# Altium schematic sheet NodeBoard.SchDoc: Data Collection Node
size Letter; Date: 24-03-2019; Author: Morten Kals; CompanyName: UBC Ecohydrology; Engineer: Erik and Morten; Organization: UBC Ecohydrology; Address2: Design:; Address3: Erik MacLennan; Address4: Morten Kals; DocumentNumber: DOC-0001; Revision: V1; SheetNumber: 1; SheetTotal: 1; ImagePath: UBC_logo.png
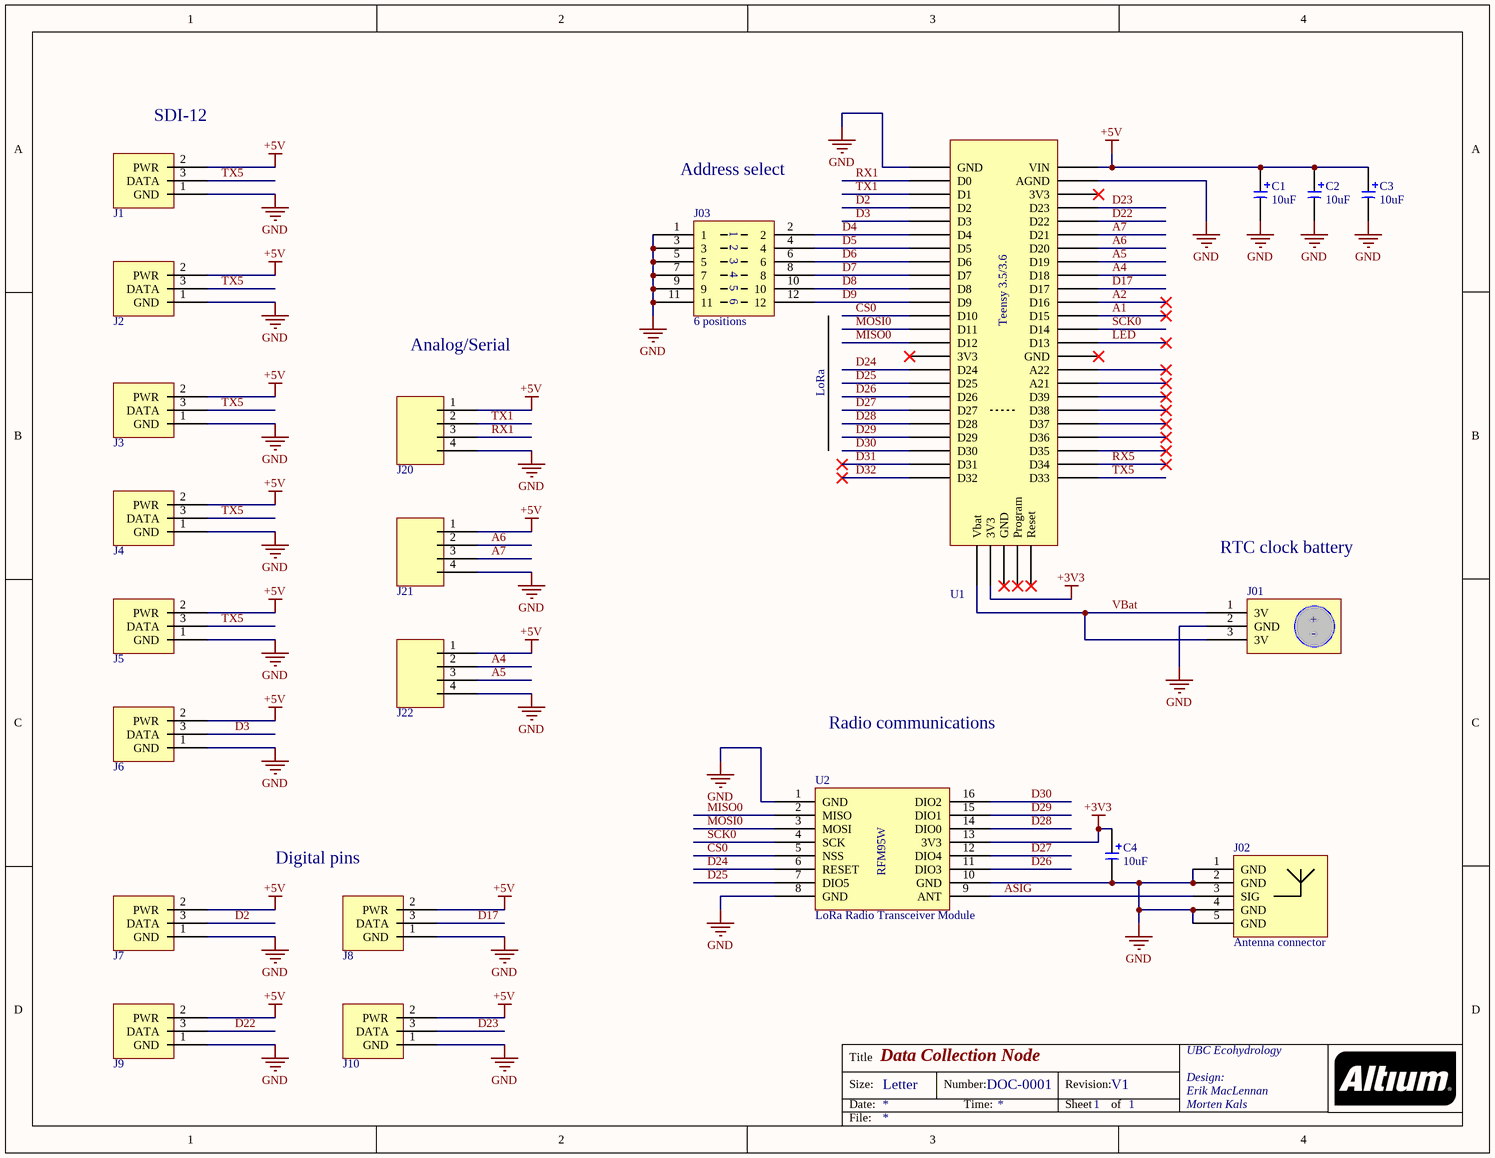
[diagram p0: NodeBoard.SchDoc]

## Parts
C1  10uF  [Cap small electrolytic]
C2  10uF  [Cap small electrolytic]
C3  10uF  [Cap small electrolytic]
C4  10uF  [Cap small electrolytic]
J01  Battery Retainer Coin, 20.0mm 1 Cell SMD (SMT) Tab  [Coin Battery]  (value not drawn)
J1  TERM BLOCK PCB 3POS 3.5MM GREEN  [Terminal Block Sen 3 pos jack]  (value not drawn)
J02  Antenna connector  [SMA Edge Connector]
J2  TERM BLOCK PCB 3POS 3.5MM GREEN  [Terminal Block Sen 3 pos jack]  (value not drawn)
J3  TERM BLOCK PCB 3POS 3.5MM GREEN  [Terminal Block Sen 3 pos jack]  (value not drawn)
J03  6 positions  [DIP SW 6 POS]
J4  TERM BLOCK PCB 3POS 3.5MM GREEN  [Terminal Block Sen 3 pos jack]  (value not drawn)
J5  TERM BLOCK PCB 3POS 3.5MM GREEN  [Terminal Block Sen 3 pos jack]  (value not drawn)
J6  TERM BLOCK PCB 3POS 3.5MM GREEN  [Terminal block SEN 3 pos label]  (value not drawn)
J7  TERM BLOCK PCB 3POS 3.5MM GREEN  [Terminal block SEN 3 pos label]  (value not drawn)
J8  TERM BLOCK PCB 3POS 3.5MM GREEN  [Terminal Block Sen 3 pos jack]  (value not drawn)
J9  TERM BLOCK PCB 3POS 3.5MM GREEN  [Terminal Block Sen 3 pos jack]  (value not drawn)
J10  TERM BLOCK PCB 3POS 3.5MM GREEN  [Terminal block SEN 3 pos label]  (value not drawn)
J20  TERM BLOCK PCB 4POS 3.5MM GREEN  [Terminal block 4 position]  (value not drawn)
J21  TERM BLOCK PCB 4POS 3.5MM GREEN  [Terminal block 4 position]  (value not drawn)
J22  TERM BLOCK PCB 4POS 3.5MM GREEN  [Terminal block 4 position]  (value not drawn)
U1  Teensy 3.5/3.6  [Teensy 3.6]  (value not drawn)
U2  LoRa Radio Transceiver Module  [RFM9x]

## Nets
+3V3: C4.2 U1.50(3V3) U2.13(3V3)
+5V: C1.2 C2.2 C3.2 J1.2(PWR) J2.2(PWR) J3.2(PWR) J4.2(PWR) J5.2(PWR) J6.2(PWR) J7.2(PWR) J8.2(PWR) J9.2(PWR) J10.2(PWR) J20.1 J21.1 J22.1 U1.48(VIN)
GND: C1.1 C2.1 C3.1 C4.1 J1.1(GND) J01.2(GND) J02.1(GND) J2.1(GND) J02.2(GND) J02.4(GND) J02.5(GND) J3.1(GND) J03.1 J03.3 J03.5 J03.7 J03.9 J03.11 J4.1(GND) J5.1(GND) J6.1(GND) J7.1(GND) J8.1(GND) J9.1(GND) J10.1(GND) J20.4 J21.4 J22.4 U1.1(GND) U1.47(AGND) U2.1(GND) U2.8(GND) U2.10(GND)
A1: U1.37(D15)
A2: U1.38(D16)
A4: J22.2 U1.40(D18)
A5: J22.3 U1.41(D19)
A6: J21.2 U1.42(D20)
A7: J21.3 U1.43(D21)
ASIG: J02.3(SIG) U2.9(ANT)
CS0: U1.12(D10) U2.5(NSS)
D2: J7.3(DATA) U1.4(D2)
D3: J6.3(DATA) U1.5(D3)
D4: J03.2 U1.6(D4)
D5: J03.4 U1.7(D5)
D6: J03.6 U1.8(D6)
D7: J03.8 U1.9(D7)
D8: J03.10 U1.10(D8)
D9: J03.12 U1.11(D9)
D17: J8.3(DATA) U1.39(D17)
D22: J9.3(DATA) U1.44(D22)
D23: J10.3(DATA) U1.45(D23)
D24: U1.16(D24) U2.6(RESET)
D25: U1.17(D25) U2.7(DIO5)
D26: U1.18(D26) U2.11(DIO3)
D27: U1.19(D27) U2.12(DIO4)
D28: U1.20(D28) U2.14(DIO0)
D29: U1.21(D29) U2.15(DIO1)
D30: U1.22(D30) U2.16(DIO2)
D31: U1.23(D31)
D32: U1.24(D32)
LED: U1.35(D13)
MISO0: U1.14(D12) U2.2(MISO)
MOSI0: U1.13(D11) U2.3(MOSI)
RX1: J20.3 U1.2(D0)
RX5: U1.26(D34)
SCK0: U1.36(D14) U2.4(SCK)
TX1: J20.2 U1.3(D1)
TX5: J1.3(DATA) J2.3(DATA) J3.3(DATA) J4.3(DATA) J5.3(DATA) U1.25(D33)
VBat: J01.1(3V) J01.3(3V) U1.49(Vbat)

Not connected (* = marked no-connect by the designer): U1 15(3V3)* 27(D35)* 28(D36)* 29(D37)* 30(D38)* 31(D39)* 32(A21)* 33(A22)* 34(GND)* 46(3V3)* 51(GND)* 52(Program)* 53(Reset)*

## Notes on the sheet
- (near J1) SDI-12
- Address select
- Analog/Serial
- LoRa
- RTC clock battery
- Radio communications
- (near J8) Digital pins
- Title
- Size:
- Date:
- Letter
- Number:
- Time:
- Revision:
- Sheet
- of
- File:
- (in symbol Coin Battery) +; -

## Library data of the parts
C1-C4 = Capacitor Electrolytic 10uF
J01 = Coin Battery: Manufacturer: Memory Protection Devices; Manufacturer Part Number: BK-883-TR; Number of Cells: 1; Supplier 1: Digi-Key; Stock 1: 118723; Pricing 1: 1 = 0.73000, 10 = 0.66100, 100 = 0.51380 (USD); RoHS: Yes; Mount: PCB,Surface Mount; Case/Package: SMD/SMT; Min Operating Temperature: -40°C; Max Operating Temperature: 270°C; Package Quantity: 450; Termination: SMD/SMT; Packaging: Cut Tape; Diameter: 20mm; Lead Free: Lead Free; ComponentLink1URL: http://media.digikey.com/pdf/Data%20Sheets/Memory%20Protection%20PDFs/BK-883-TR.pdf?src-supplier=Digi-Key; ComponentLink1Description: http://media.digikey.com/pdf/Data%20Sheets/Memory%20Protection%20PDFs/BK-883-TR.pdf?src-supplier=Digi-Key; Supplier Part Number 1: BK-883-CT-ND
J1-J10 = Terminal Block Sensor: 3 Position Wire to Board Terminal Block 45° (135°) Angle with Board 0.138" (3.50mm) Through Hole; Manufacturer: Phoenix Contact; Manufacturer Part Number: 1985205; Number of Poles: 3; Voltage Rating: 250V; Max Current Rating: 2A; Number of Levels: 1; Voltage: 300V; Wire Gauge (Max): 24AWG; Wire Gauge (Min): 16AWG; Stripping Length: 8mm; Approvals: UL,VDE; Supplier 1: Digi-Key; Stock 1: 12841; Pricing 1: 1=0.41, 10=0.391, 50=0.374, 100=0.3638, 250=0.34, 500=0.3128, 1000=0.289 (USD); Mount: Through Hole; Number of Pins: 3; Weight: 0.054322oz; Colour: Green; Material: Nylon; Housing Colour: Green; Housing Material: Polyamide; Insulation Material: Nylon; Contact Material: Tin; Current Rating: 2A; Package Quantity: 250; Packaging: Bulk; Number of Rows: 1; Max Supply Voltage: 250V; Number of Positions Per Level: 3; Current: 2A; Termination: Solder; Number of Positions: 3; Number of Contacts: 3; Number of Circuits: 3; Length: 12mm; Height: 13.1mm; Width: 16.7mm; Pitch: 3.5mm; Depth: 12mm; Wire/Cable Gauge: 16AWG; Radiation Hardening: No; Lead Free: Lead Free; Flammability Rating: UL94 V-2; ComponentLink1URL: https://media.digikey.com/pdf/Data%20Sheets/Phoenix%20Contact%20PDFs/COMBICON%20Spring-Cage%20PCB%20Term.%20Blocks.pdf; ComponentLink1Description: https://media.digikey.com/pdf/Data%20Sheets/Phoenix%20Contact%20PDFs/COMBICON%20Spring-Cage%20PCB%20Term.%20Blocks.pdf; ComponentLink2URL: https://www.verical.com/server-webapp/html/getDatasheet?partID=743520; ComponentLink2Description: https://www.verical.com/server-webapp/html/getDatasheet?partID=743520; ComponentLink3URL: https://www.alliedelec.com/m/d/46afd96412b1b8fa400ea99294e4d68a.pdf; ComponentLink3Description: https://www.alliedelec.com/m/d/46afd96412b1b8fa400ea99294e4d68a.pdf; Supplier Part Number 1: 277-1623-ND
J02 = SMA Connector: Manufacturer: Molex; Manufacturer Part Number: 73251-1150; Body Material: Brass; Body Plating: Gold; Impedance: 50R; Connector Type: Coaxial,SMA; Gender: Female; Polarity: Normal,Standard; ComponentLink1Description: Datasheet; ComponentLink1URL: https://www.molex.com/pdm_docs/sd/732511150_sd.pdf; Supplier 1: Digi-Key; Stock 1: 9431; Pricing 1: 1 = 3.49000, 10 = 3.35300, 25 = 3.07360, 50 = 2.93400, 100 = 2.79420, 250 = 2.44492, 500 = 2.37508, 1600 = 1.95594, 3200 = 1.88608 (USD); RoHS: Yes; Mount: Edge,PCB; Case/Package: SMA; Contact Material: Copper; Contact Plating: Gold; Plating: Gold; Packaging: Bulk; Package Quantity: 1600; Termination: Solder; Orientation: Right Angle; Radiation Hardening: No; Lead Free: Lead Free; REACH SVHC: Unknown; Halogen Free: Low Halogen; ComponentLink2URL: http://www.farnell.com/datasheets/1596721.pdf?src-supplier=Farnell; ComponentLink2Description: http://www.farnell.com/datasheets/1596721.pdf?src-supplier=Farnell; ComponentLink3URL: http://www.onlinecomponents.com/productFiles/mf-MOL/367520732511150_rf_coax_nectors.pdf?src-supplier=Onlinecomponents.com; ComponentLink3Description: http://www.onlinecomponents.com/productFiles/mf-MOL/367520732511150_rf_coax_nectors.pdf?src-supplier=Onlinecomponents.com; ComponentLink4URL: http://www.molex.com/webdocs/datasheets/pdf/en-us/0732511150_RF_COAX_CONNECTORS.pdf?src-supplier=Avnet; ComponentLink4Description: http://www.molex.com/webdocs/datasheets/pdf/en-us/0732511150_RF_COAX_CONNECTORS.pdf?src-supplier=Avnet; ComponentLink5URL: http://www.farnell.com/datasheets/2698429.pdf?src-supplier=Newark; ComponentLink5Description: http://www.farnell.com/datasheets/2698429.pdf?src-supplier=Newark; ComponentLink6URL: http://www.farnell.com/datasheets/2130139.pdf?src-supplier=Element14; ComponentLink6Description: http://www.farnell.com/datasheets/2130139.pdf?src-supplier=Element14; ComponentLink7URL: http://www.mouser.com/ds/2/276/0732511150_RF_COAX_CONNECTORS-173168.pdf?src-supplier=Mouser; ComponentLink7Description: http://www.mouser.com/ds/2/276/0732511150_RF_COAX_CONNECTORS-173168.pdf?src-supplier=Mouser; ComponentLink8URL: http://www.molex.com/webdocs/datasheets/pdf/en-us/0732511150_RF_COAX_CONNECTORS.pdf?src-supplier=Avnet+Europe; ComponentLink8Description: http://www.molex.com/webdocs/datasheets/pdf/en-us/0732511150_RF_COAX_CONNECTORS.pdf?src-supplier=Avnet+Europe; ComponentLink9URL: http://www.onlinecomponents.com/productFiles/mf-MOL/473370732511150_rf_coax_nectors.pdf?src-supplier=Onlinecomponents.com; ComponentLink9Description: http://www.onlinecomponents.com/productFiles/mf-MOL/473370732511150_rf_coax_nectors.pdf?src-supplier=Onlinecomponents.com; ComponentLink10URL: http://www.farnell.com/datasheets/1596721.pdf?src-supplier=Element14; ComponentLink10Description: http://www.farnell.com/datasheets/1596721.pdf?src-supplier=Element14; ComponentLink11URL: http://uk.rs-online.com/webdocs/13c4/0900766b813c49cf.pdf?src-supplier=RSComponents; ComponentLink11Description: http://uk.rs-online.com/webdocs/13c4/0900766b813c49cf.pdf?src-supplier=RSComponents; Supplier Part Number 1: WM5534-ND
J03 = DIP Switch: Manufacturer: TE Connectivity; Manufacturer Part Number: 1825057-5; Actuator Material: Polyamide; Voltage Rating (DC): 5V; Contact Resistance: 50mR; Throw Configuration: SPST; Max Current Rating: 100mA; Max Voltage Rating (DC): 24V; Number of Positions: 6; Switching Capacity: 400mW; Electrical Life: 1000Cycles; Contact Current Rating: 1A; Sealable: No (Without); Actuator Type: Standard; Pitch: 0.1inch; Actuator Length: 1mm; Contact Post Length: 4mm; Washable: Yes; Supplier 1: Digi-Key; Stock 1: 8675; Pricing 1: 1 = 1.09000, 10 = 1.06900, 25 = 1.00680, 50 = 0.94520, 100 = 0.90420, 250 = 0.86308, 500 = 0.78086, 1000 = 0.71922, 5000 = 0.58565 (USD); RoHS: Yes; Mount: Through Hole; Number of Pins: 6; Contact Material: Copper Alloy; Contact Plating: Gold; Housing Color: Black; Housing Material: Polyphenylene; Min Operating Temperature: -30°C; Max Operating Temperature: 85°C; Package Quantity: 25; Packaging: Rail/Tube; Termination: PC Pins; Number of Circuits: 6; Orientation: Straight; Type: Switch; Length: 17.22mm; Height: 0.138inch; Width: 7.5mm; Terminal Pitch: 2.54mm; Depth: 7.49mm; Radiation Hardening: No; REACH SVHC: No SVHC; Lead Free: Lead Free; ELV: Compliant; Flammability Rating: UL94 V-0; ComponentLink1URL: https://datasheet.ciiva.com/16312/eng-cs-1308111-1-switches-core-program-catalog-0308-16312710.pdf?src-supplier=Future+Electronics; ComponentLink1Description: https://datasheet.ciiva.com/16312/eng-cs-1308111-1-switches-core-program-catalog-0308-16312710.pdf?src-supplier=Future+Electronics; ComponentLink2URL: https://datasheet.ciiva.com/26330/701621-da-01-en-dip-schalter-6polade-0604-26330291.pdf?src-supplier=Conrad; ComponentLink2Description: https://datasheet.ciiva.com/26330/701621-da-01-en-dip-schalter-6polade-0604-26330291.pdf?src-supplier=Conrad; ComponentLink3URL: https://datasheet.ciiva.com/8677/eng-cd-1825057-o2-8677113.pdf?src-supplier=Avnet; ComponentLink3Description: https://datasheet.ciiva.com/8677/eng-cd-1825057-o2-8677113.pdf?src-supplier=Avnet; ComponentLink4URL: https://datasheet.ciiva.com/17431/eng-cd-1825057-o2-17431643.pdf?src-supplier=Avnet+Europe; ComponentLink4Description: https://datasheet.ciiva.com/17431/eng-cd-1825057-o2-17431643.pdf?src-supplier=Avnet+Europe; ComponentLink5URL: https://datasheet.ciiva.com/30052/7365eng-cd-1825057-o2-30052347.pdf?src-supplier=Onlinecomponents.com; ComponentLink5Description: https://datasheet.ciiva.com/30052/7365eng-cd-1825057-o2-30052347.pdf?src-supplier=Onlinecomponents.com; Supplier Part Number 1: 450-1365-ND
J20-J22 = Terminal Block 4 pos: 4 Position Wire to Board Terminal Block 45° (135°) Angle with Board 0.138" (3.50mm) Through Hole; Manufacturer: Phoenix Contact; Manufacturer Part Number: 1985205; Number of Poles: 3; Voltage Rating: 250V; Max Current Rating: 2A; Number of Levels: 1; Voltage: 300V; Wire Gauge (Max): 24AWG; Wire Gauge (Min): 16AWG; Stripping Length: 8mm; Approvals: UL,VDE; Stock 1: 12841; Pricing 1: 1=0.41, 10=0.391, 50=0.374, 100=0.3638, 250=0.34, 500=0.3128, 1000=0.289 (USD); Mount: Through Hole; Number of Pins: 3; Weight: 0.054322oz; Colour: Green; Material: Nylon; Housing Colour: Green; Housing Material: Polyamide; Insulation Material: Nylon; Contact Material: Tin; Current Rating: 2A; Package Quantity: 250; Packaging: Bulk; Number of Rows: 1; Max Supply Voltage: 250V; Number of Positions Per Level: 3; Current: 2A; Termination: Solder; Number of Positions: 3; Number of Contacts: 3; Number of Circuits: 3; Length: 12mm; Height: 13.1mm; Width: 16.7mm; Pitch: 3.5mm; Depth: 12mm; Wire/Cable Gauge: 16AWG; Radiation Hardening: No; Lead Free: Lead Free; Flammability Rating: UL94 V-2; ComponentLink1URL: https://media.digikey.com/pdf/Data%20Sheets/Phoenix%20Contact%20PDFs/COMBICON%20Spring-Cage%20PCB%20Term.%20Blocks.pdf; ComponentLink1Description: https://media.digikey.com/pdf/Data%20Sheets/Phoenix%20Contact%20PDFs/COMBICON%20Spring-Cage%20PCB%20Term.%20Blocks.pdf; ComponentLink2URL: https://www.verical.com/server-webapp/html/getDatasheet?partID=743520; ComponentLink2Description: https://www.verical.com/server-webapp/html/getDatasheet?partID=743520; ComponentLink3URL: https://www.alliedelec.com/m/d/46afd96412b1b8fa400ea99294e4d68a.pdf; ComponentLink3Description: https://www.alliedelec.com/m/d/46afd96412b1b8fa400ea99294e4d68a.pdf; Supplier Part Number 1: 277-1623-ND; Supplier 2: Digi-Key; Supplier 1: Digi-Key; Supplier Part Number 2: 277-1624-ND
U1 = Teensy 3.5/6
U2 = RFM95W: Manufacturer: RF Solutions; Manufacturer Part Number: RFM95W-915S2; ComponentLink1Description: Datasheet; ComponentLink1URL: https://cdn-learn.adafruit.com/assets/assets/000/031/659/original/RFM95_96_97_98W.pdf?1460518717; Supplier 1: Digi-Key; Stock 1: 802; Pricing 1: 1 = 13.84000 (USD); Supplier Part Number 1: RFM95W-915S2-ND; ComponentLink2Description: Adafruit; ComponentLink2URL: https://www.adafruit.com/product/3072; ComponentLink3Description: Digikey; ComponentLink3URL: https://www.digikey.ca/product-detail/en/rf-solutions/RFM95W-915S2/RFM95W-915S2-ND/6564923